# EAGLE design 1022main (EAGLE 6.0)
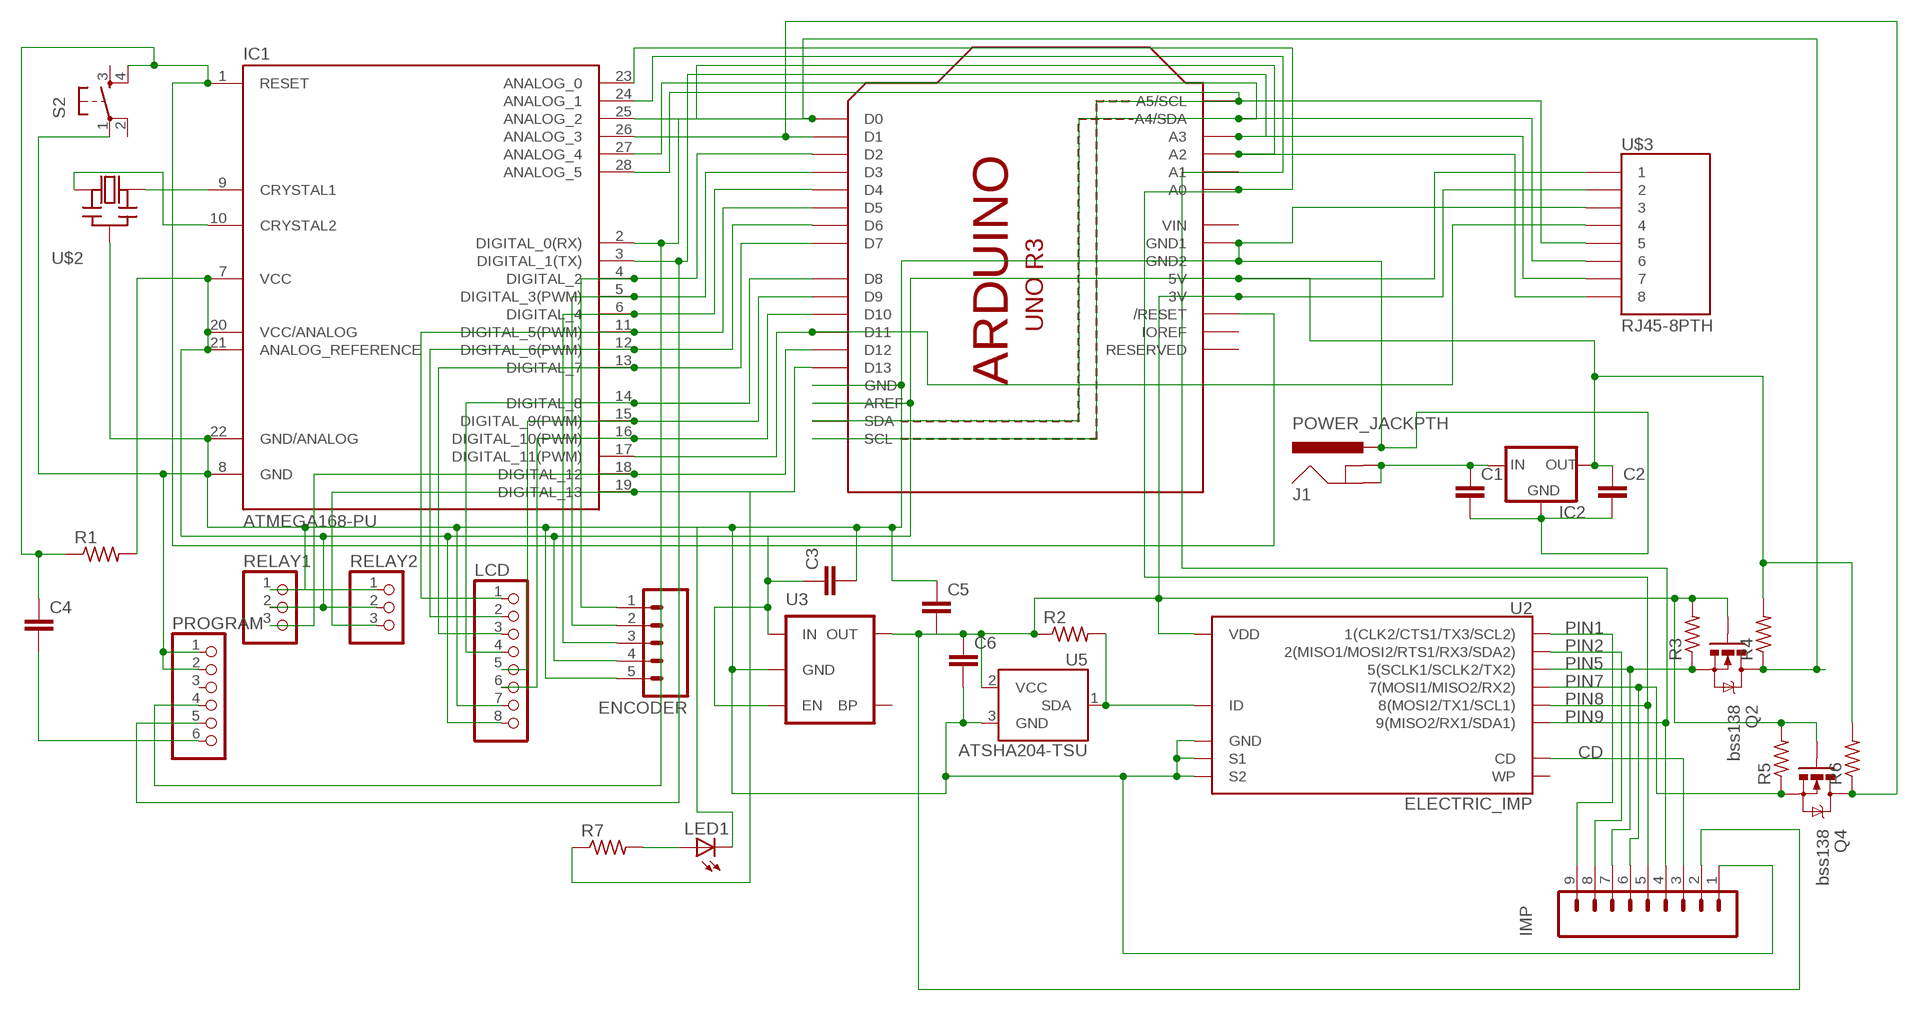
[diagram p0: schematic, sheet 1]

## Parts
C1  CAPPTH  [CAP-PTH-SMALL]
C2  CAPPTH  [CAP-PTH-SMALL]
C3  CAPPTH  [CAP-PTH-SMALL]
C4  CAPPTH  [CAP-PTH-SMALL]
C5  CAPPTH  [CAP-PTH-SMALL]
C6  CAPPTH  [CAP-PTH-SMALL]
ENCODER  M05PTH  [1X05]
IC1  ATMEGA168-PU  [DIL28-3]
IC2  V_REG_78XX-TO-220  [TO-220-ALT]
IMP  M09  [1X09]
J1  POWER_JACKPTH  [POWER_JACK_PTH]
LCD  PINHD-1X8CLEANBIG  [1X08-CLEANBIG]
LED1  LED3MM  [LED3MM]
PROGRAM  PINHD-1X6  [1X06]
Q2  bss138  MOSFET-NCHANNELSMD  [SOT23-3]
Q4  bss138  MOSFET-NCHANNELSMD  [SOT23-3]
R1  R-US_0204/7  [0204/7]
R2  R-US_0204/7  [0204/7]
R3  R-US_0204/7  [0204/7]
R4  R-US_0204/7  [0204/7]
R5  R-US_0204/7  [0204/7]
R6  R-US_0204/7  [0204/7]
R7  R-US_0204/7  [0204/7]
RELAY1  PINHD-1X3  [1X03]
RELAY2  PINHD-1X3  [1X03]
S2  TAC_SWITCHPTH  [TACTILE-PTH]
U1  ARDUINOR3-DIMENSION  [ARDUINOR3]
U2  ELECTRIC_IMP  [SD_MMC_SOCKET]
U3  V_REG_MIC52193.3V  [SOT23-5]
U5  ATSHA204-TSU  [SOT23-3]
U$2  CERMOSCILL-THM  [CERM_OSC]
U$3  RJ45-8PTH  [RJ45-8]

## Nets
3.3V: C5.2 C6.1 IMP.2 Q2.1(G) Q4.1(G) R2.1 R3.2 R5.2 U1.3V U2.4(VDD) U3.5(OUT) U5.2(VCC) U$3.2
CD: IMP.3 U2.CD
GND: C1.2 C2.2 C3.2 C5.1 C6.2 ENCODER.5 IC1.8(GND) IC1.22(GND/ANALOG) IC2.GND IMP.1 J1.PWR LCD.7 LED1.K(C) PROGRAM.1 PROGRAM.2 RELAY1.1 RELAY2.1 S2.1 U1.GND U1.GND1 U1.GND2 U2.3(GND) U2.S1 U2.S2 U3.2(GND) U5.3(GND) U$2.P$2(GND) U$3.3
N$1: IC1.19(DIGITAL_13) R7.1 RELAY2.3 U1.D13
N$2: IC1.18(DIGITAL_12) RELAY1.3 U1.D12
N$3: IC1.17(DIGITAL_11(PWM)) U1.D11 U$3.4
N$4: IC1.16(DIGITAL_10(PWM)) LCD.6 U1.D10
N$5: IC1.15(DIGITAL_9(PWM)) LCD.5 U1.D9
N$6: IC1.14(DIGITAL_8) LCD.4 U1.D8
N$7: IC1.13(DIGITAL_7) LCD.3 U1.D7
N$8: IC1.12(DIGITAL_6(PWM)) LCD.2 U1.D6
N$9: IC1.11(DIGITAL_5(PWM)) LCD.1 U1.D5
N$10: ENCODER.3 IC1.6(DIGITAL_4) U1.D4
N$11: ENCODER.2 IC1.5(DIGITAL_3(PWM)) U1.D3
N$12: ENCODER.1 IC1.4(DIGITAL_2) U1.D2
N$13: IC1.3(DIGITAL_1(TX)) PROGRAM.5 Q4.3(D) R6.1 U1.D1
N$14: IC1.2(DIGITAL_0(RX)) PROGRAM.4 Q2.3(D) R4.1 U1.D0
N$15: IC1.27(ANALOG_4) U1.A4(A4/SDA) U1.SDA U$3.6
N$16: IC1.28(ANALOG_5) U1.A5(A5/SCL) U1.SCL U$3.5
N$17: LED1.A R7.2
N$19: IC1.25(ANALOG_2) U1.A2 U$3.8
N$20: IC1.26(ANALOG_3) U1.A3 U$3.7
N$23: R2.2 U2.6(ID) U5.1(SDA)
N$24: C1.1 IC2.IN J1.GND J1.GNDBREAK
N$25: C4.2 PROGRAM.6
N$26: IC1.9(CRYSTAL1) U$2.P$3(OUT)
N$28: IC1.10(CRYSTAL2) U$2.P$1(IN)
N$35: C2.1 C3.1 ENCODER.4 IC1.7(VCC) IC1.20(VCC/ANALOG) IC1.21(ANALOG_REFERENCE) IC2.OUT LCD.8 R1.2 R4.2 R6.2 RELAY1.2 RELAY2.2 U1.5V U1.AREF U3.1(IN) U3.3(EN) U$3.1
PIN1: IMP.9 U2.1(1(CLK2/CTS1/TX3/SCL2))
PIN2: IMP.8 U2.2(2(MISO1/MOSI2/RTS1/RX3/SDA2))
PIN5: IMP.7 Q2.2(S) R3.1 U2.5(5(SCLK1/SCLK2/TX2))
PIN7: IMP.6 Q4.2(S) R5.1 U2.7(7(MOSI1/MISO2/RX2))
PIN8: IC1.23(ANALOG_0) IMP.5 U1.A0 U2.8(8(MOSI2/TX1/SCL1))
PIN9: IC1.24(ANALOG_1) IMP.4 U1.A1 U2.9(9(MISO2/RX1/SDA1))
RELAY1: C4.1 IC1.1(RESET) R1.1 S2.4 U1.RESET(/RESET)
Unconnected: PROGRAM.3 S2.2 S2.3 U1.IOREF U1.RESERVED U2.WP U3.4(BP)

## Power pins joined to a net without a drawn wire
VIN: U1.VIN

## Library data of the parts
C1-C6 = SparkFun:CAP: Capacitor Standard 0603 ceramic capacitor, and 0.1" leaded capacitor.
ENCODER = SparkFun-Connectors:M05: Header 5 Standard 5-pin 0.1" header. Use with straight break away headers (SKU : PRT-00116), right angle break away headers (PRT-00553), swiss pins (PRT-00743), machine pins (PRT-00117), and female headers (PRT-00115). Molex polarized connector foot print use with SKU : PRT-08230 with associated crimp pins and housings.
IC1 = Arduino-AVR:ATMEGA168-PU
IC2 = SparkFun:V_REG_78XX: Voltage Regulator Standard 7805 5V regulator. IGO (Input Ground Output). Spark Fun Electronics SKU : COM-00107
IMP = SparkFun:M09: Header 9 Standard 9-pin 0.1" header. Use with straight break away headers (SKU : PRT-00116), right angle break away headers (PRT-00553), swiss pins (PRT-00743), machine pins (PRT-00117), and female headers (PRT-00115).
J1 = SparkFun:POWER_JACK: Power Jack This is the standard 5.5mm barrel jack for power. The PTH is the most common, proven, reliable, footprint. All others are experimental. The Slot footprint only works if the mill layer is transmitted to the PCB fab house so be warned. Spark Fun Electronics SKU : PRT-00119. Mating wall wart : TOL-00298 (and others)
LCD = adafruit:PINHD-1X8: PIN HEADER
LED1 = adafruit:LED: LED OSRAM: - CHIPLED LG R971, LG N971, LY N971, LG Q971, LY Q971, LO R971, LY R971 LH N974, LH R974 LS Q976, LO Q976, LY Q976 LO Q996 - Hyper CHIPLED LW Q18S LB Q993, LB Q99A, LB R99A - SideLED LS A670, LO A670, LY A670, LG A670, LP A670 LB A673, LV A673, LT A673, LW A673 LH A674 LY A675 LS A676, LA A676, LO A676, LY A676, LW A676 LS A679, LY A679, LG A679 - Hyper Micro SIDELED® LS Y876, LA Y876, LO Y876, LY Y876 LT Y87S - SmartLED LW L88C, LW L88S LB L89C, LB L89S, LG L890 LS L89K, LO L89K, LY L89K LS L896, LA L896, LO L896, LY L896 - TOPLED LS T670, LO T670, LY T670, LG T670, LP T670 LSG T670, LSP T670, LSY T670, LOP T670, LYG T670 LG T671, LOG T671, LSG T671 LB T673, LV T673, LT T673, LW T673 LH T674 LS T676, LA T676, LO T676, LY T676, LB T676, LH T676, LSB T676, LW T676 LB T67C, LV T67C, LT T67C, LS T67K, LO T67K, LY T67K, LW E67C LS E67B, LA E67B, LO E67B, LY E67B, LB E67C, LV E67C, LT E67C LW T67C LS T679, LY T679, LG T679 LS T770, LO T770, LY T770, LG T770, LP T770 LB T773, LV T773, LT T773, LW T773 LH T774 LS E675, LA E675, LY E675, LS T675 LS T776, LA T776, LO T776, LY T776, LB T776 LHGB T686 LT T68C, LB T68C - Hyper Mini TOPLED® LB M676 - Mini TOPLED Santana® LG M470 LS M47K, LO M47K, LY M47K Source: http://www.osram.convergy.de/
PROGRAM = adafruit:PINHD-1X6: PIN HEADER
Q2 Q4 = SparkFun-DiscreteSemi:MOSFET-NCHANNEL: Generic NMOS footprint
R1-R7 = adafruit:R-US_: RESISTOR, American symbol
RELAY1 RELAY2 = adafruit:PINHD-1X3: PIN HEADER
S2 = nouveau:TAC_SWITCH: Momentary Switch Button commonly used for reset or general input. Spark Fun Electronics SKU : COM-00097
U1 = adafruit:ARDUINOR3: This is a new object for the new Arduino R3 - with extra pins that you may want to use (such as IOref, and duplicated A4/A5
U2 = SparkFun-RF:ELECTRIC_IMP
U3 = SparkFun-PowerIC:V_REG_MIC5219: V_REG MIC5219 Standard 500mA LDO voltage regulator in SOT-23 layout. Micrel part MIC5219. BP (by-pass) pin is used to lower output noise with 470pF cap, may be left open.; PROD_ID: VREG-09872; VALUE: MIC5219 3.3V
U5 = SparkFun-DigitalIC:ATSHA204
U$2 = adafruit:CERMOSCILL: Ceramic oscillator with built in capacitors such as ZTT-12MHz http://www.ladyada.net/library/eagle
U$3 = SparkFun:RJ45-8: RJ45 Jack Simple RJ45, 8-pin connection - connector for common Cat5, Cat5e, and Cat6 Ethernet cables. Footprint not yet proven in production. Connector sku is PRT-00643; Breakout PCB sku is BOB-00716.

## Board
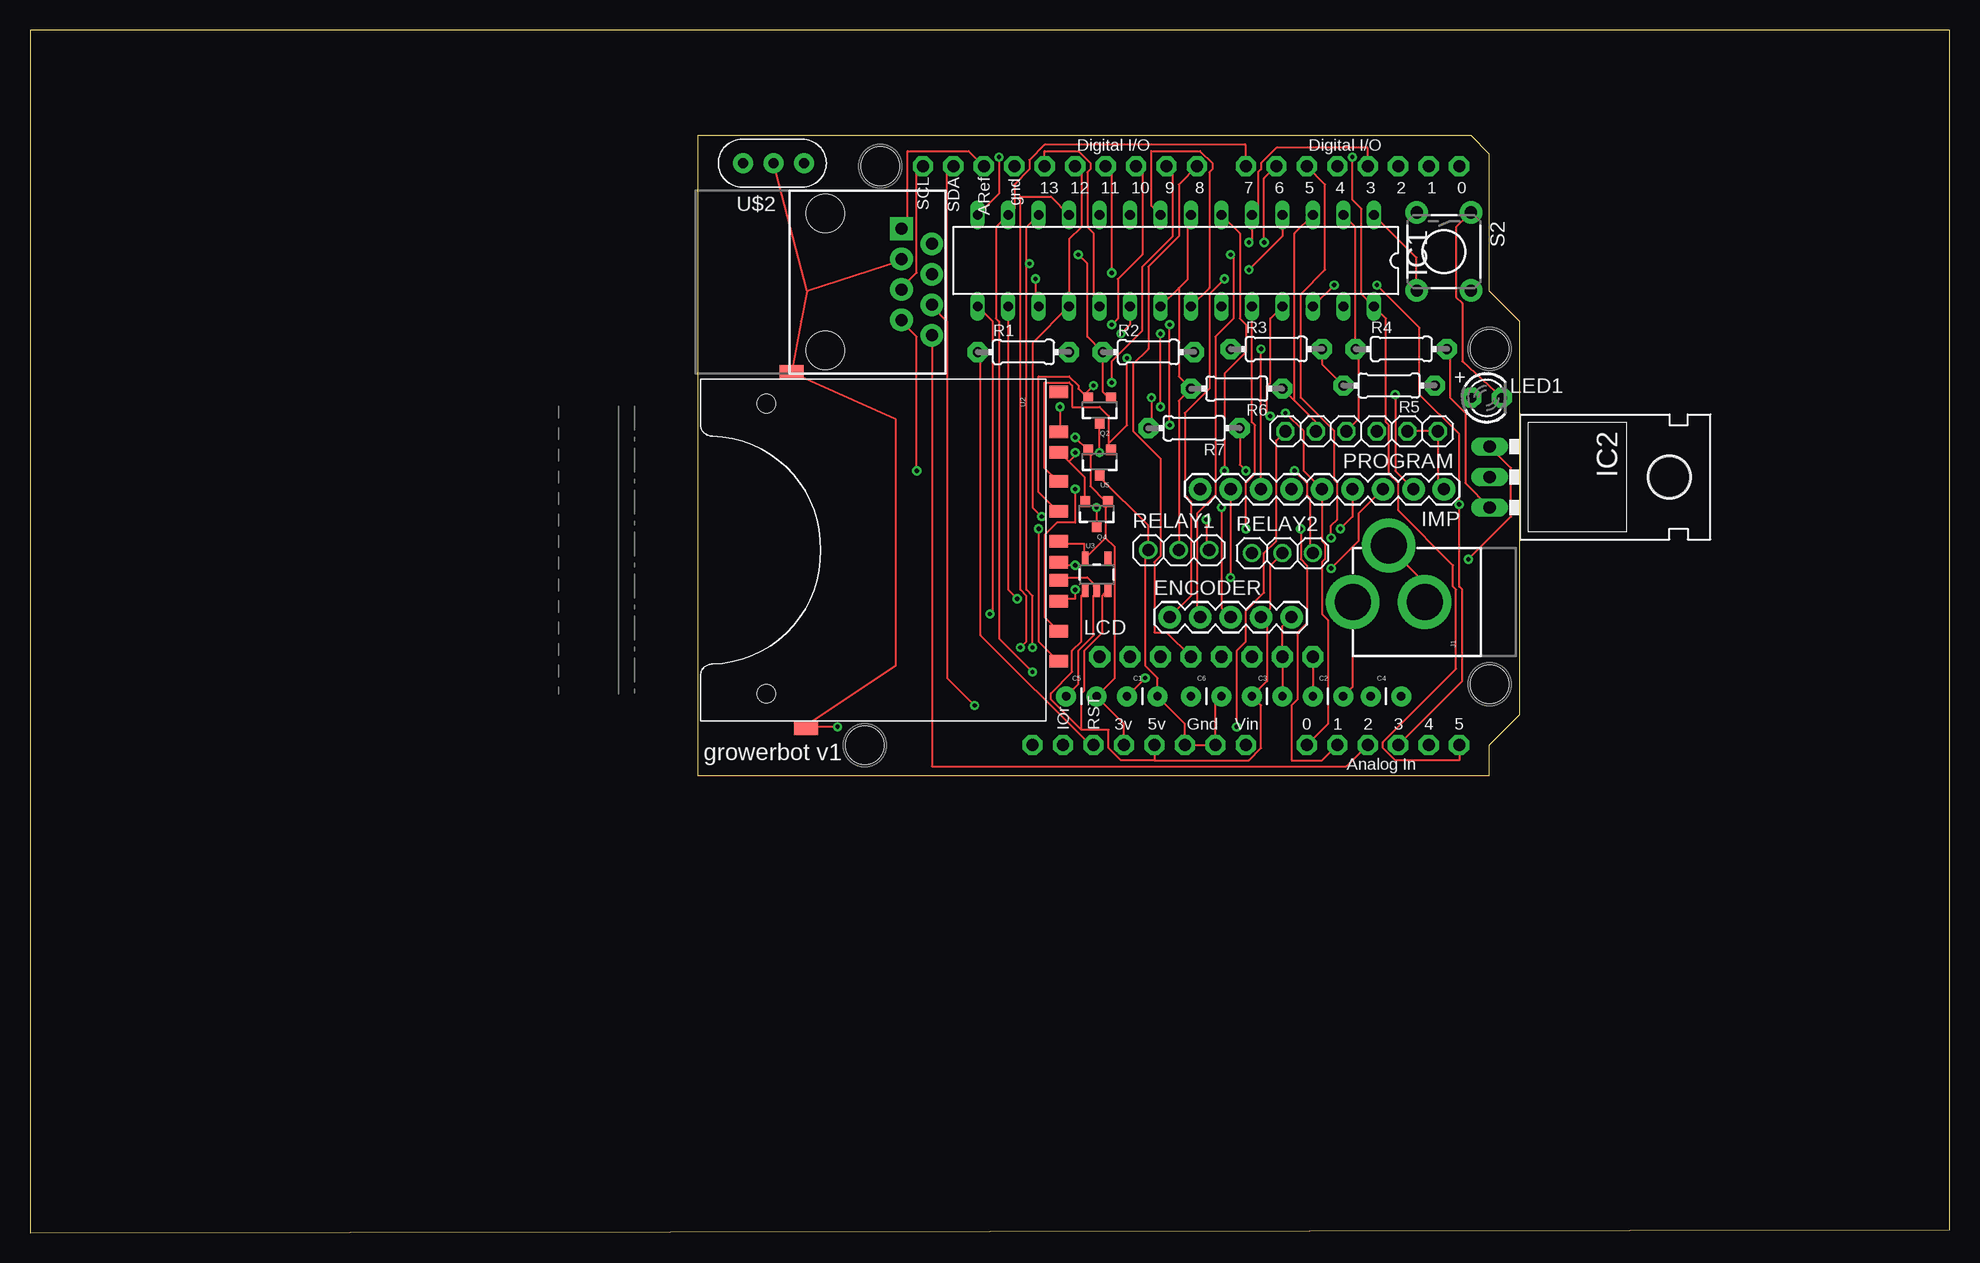
[diagram p1: board, top side]
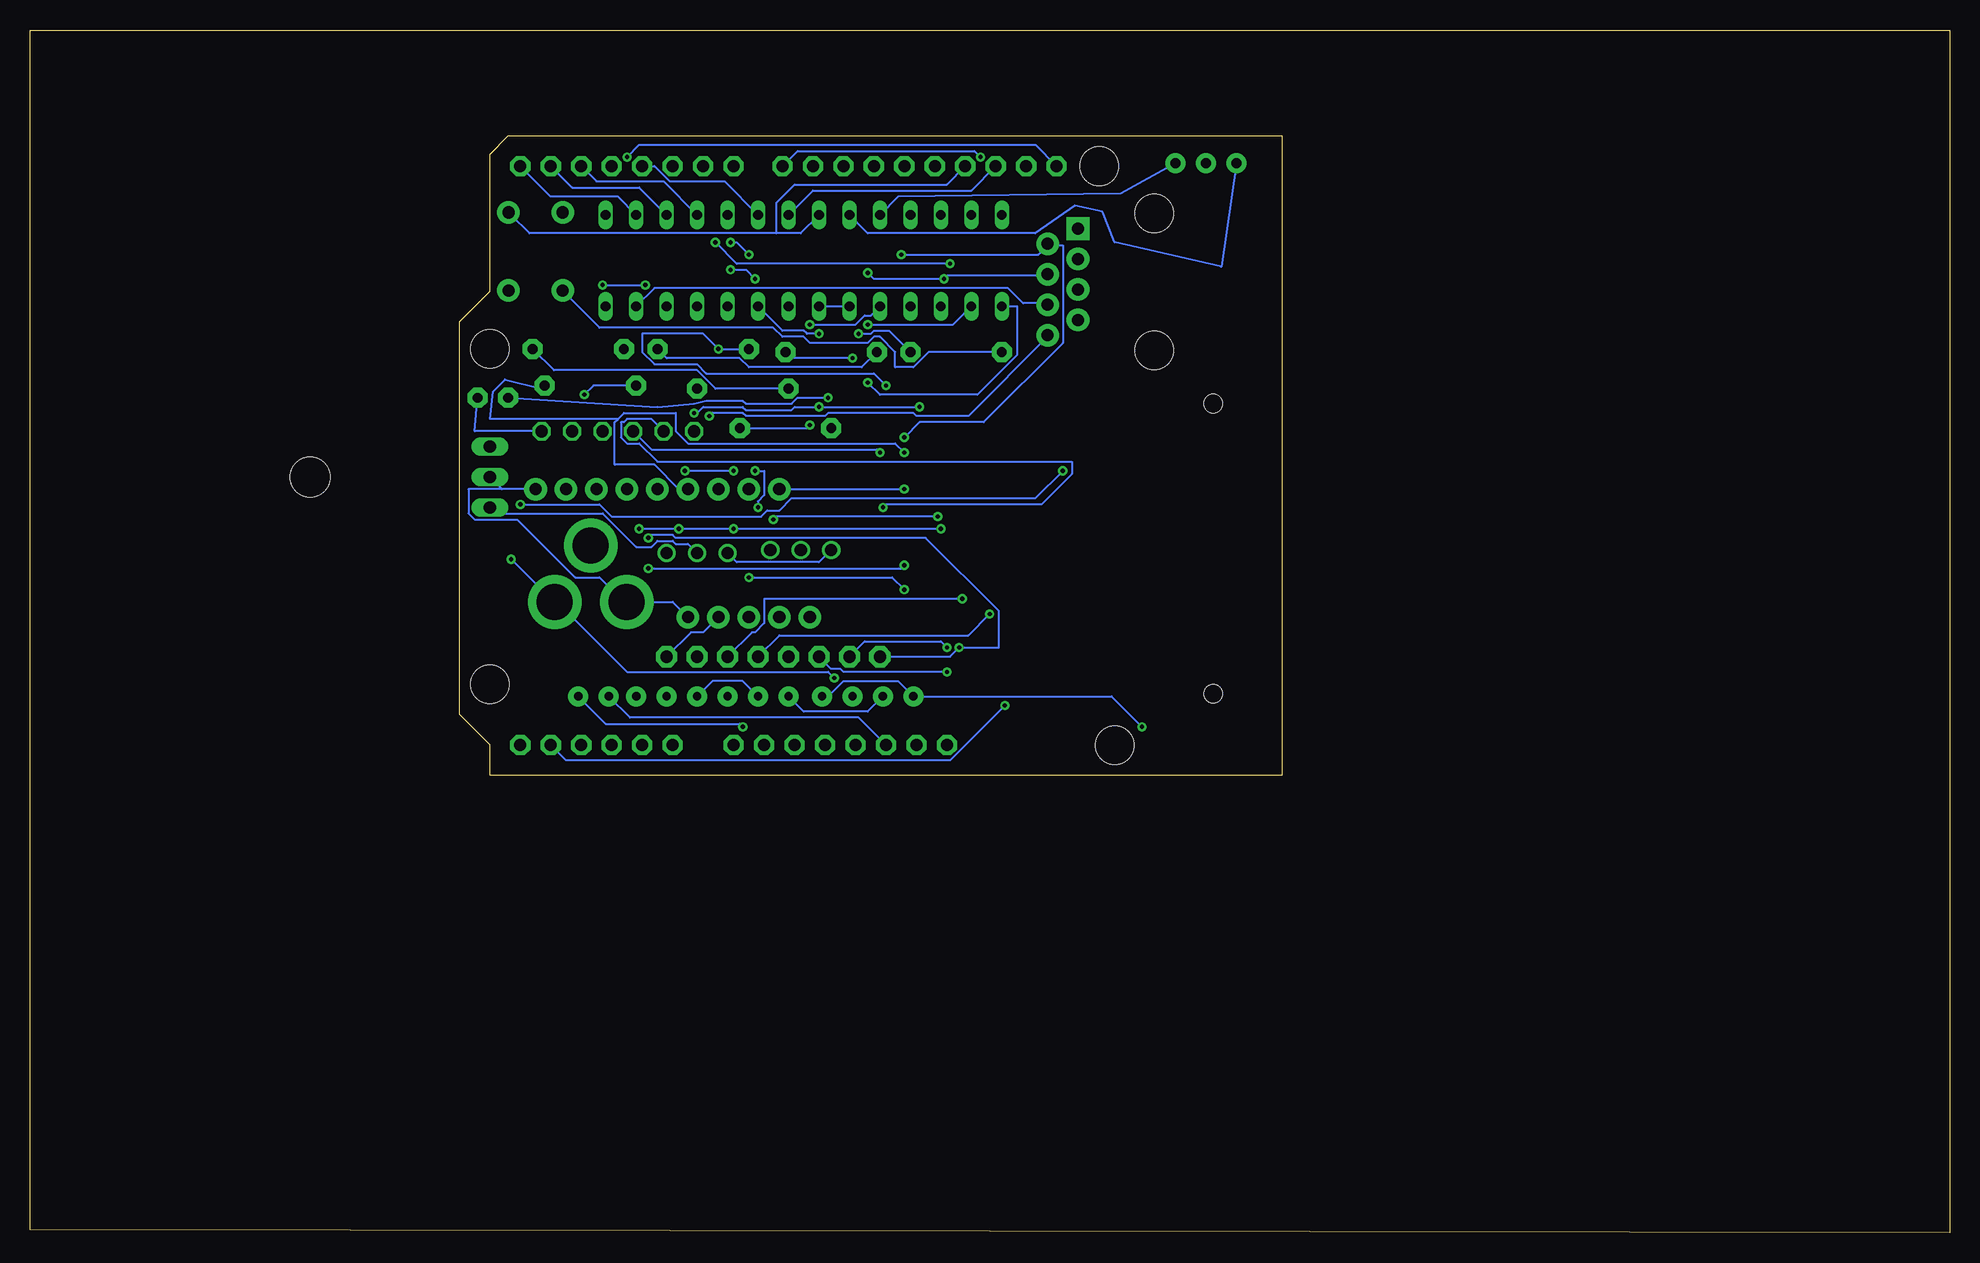
[diagram p2: board, bottom side, seen from below]

Size 160 x 100.25 mm. Coordinates in mm from the lower left corner, seen from the top.
Outline: 0,0 160,0.25 160,100.25 0,100.25 0,0
Copper layers (1*16): Top 0.0178mm / dielectric 59mil / Bottom 0.0178mm
Design rules: minimum track width 6mil, minimum drill 14mil, track to track 6mil, track to pad 6mil, pad to pad 6mil, via to via 6mil, smd to smd 6mil, copper to edge 20mil, drill to drill 16mil, minimum pad ring 8mil, minimum via ring 8mil, stop-mask expansion 3mil, vias tented up to drill 0mil, thermal gap 10mil
Holes 3.2 mm at 69.6,40.64 121.67,45.72 70.87,88.9 121.67,73.66

### Footprints (pad centres in the part's own frame; a part is rotated, then mirrored left to right if it is on the bottom)
CAP-PTH-SMALL = drill 0.7 pad 1.651: 1 0,0; 2 2.54,0
1X05 = drill 1.016 pad 1.88: 1 0,0; 2 2.54,0; 3 5.08,0; 4 7.62,0; 5 10.16,0
DIL28-3 = drill 0.813 long: 1 -16.51,-3.81; 2 -13.97,-3.81; 3 -11.43,-3.81; 4 -8.89,-3.81; 5 -6.35,-3.81; 6 -3.81,-3.81; 7 -1.27,-3.81; 8 1.27,-3.81; 9 3.81,-3.81; 10 6.35,-3.81; 11 8.89,-3.81; 12 11.43,-3.81; 13 13.97,-3.81; 14 16.51,-3.81; 15 16.51,3.81; 16 13.97,3.81; 17 11.43,3.81; 18 8.89,3.81; 19 6.35,3.81; 20 3.81,3.81; 21 1.27,3.81; 22 -1.27,3.81; 23 -3.81,3.81; 24 -6.35,3.81; 25 -8.89,3.81; 26 -11.43,3.81; 27 -13.97,3.81; 28 -16.51,3.81
TO-220-ALT = drill 1.016 long: GND 0,-3.81; IN -2.54,-3.81; OUT 2.54,-3.81 | hole 3.302: 0,11.176
1X09 = drill 1.016 pad 1.88: 1 0,0; 2 2.54,0; 3 5.08,0; 4 7.62,0; 5 10.16,0; 6 12.7,0; 7 15.24,0; 8 17.78,0; 9 20.32,0
POWER_JACK_PTH = drill 2.997 pad 4.318: GND 0,7.7; GNDBREAK 4.7,10.7; PWR 0,13.7
1X08-CLEANBIG = drill 1.016 pad 1.778 octagon: 1 -8.89,0; 2 -6.35,0; 3 -3.81,0; 4 -1.27,0; 5 1.27,0; 6 3.81,0; 7 6.35,0; 8 8.89,0
LED3MM = drill 0.813 pad 1.676 octagon: A -1.27,0; K 1.27,0
1X06 = drill 1.016 octagon: 1 -6.35,0; 2 -3.81,0; 3 -1.27,0; 4 1.27,0; 5 3.81,0; 6 6.35,0
SOT23-3 = smd 0.8 x 0.9: 1 -0.95,-1; 2 0.95,-1; 3 0,1.1
0204/7 = drill 0.813 pad 1.676 octagon: 1 -3.81,0; 2 3.81,0
1X03 = drill 1.016: 1 -2.54,0; 2 0,0; 3 2.54,0
TACTILE-PTH = drill 1.016 pad 1.88: 1 -3.251,2.261; 2 3.251,2.261; 3 -3.251,-2.261; 4 3.251,-2.261
ARDUINOR3 = drill 1 pad 1.676 octagon: 3V 35.56,2.54; 5V 38.1,2.54; A0 50.8,2.54; A1 53.34,2.54; A2 55.88,2.54; A3 58.42,2.54; A4 60.96,2.54; A5 63.5,2.54; AREF 23.876,50.8; D0 63.5,50.8; D1 60.96,50.8; D2 58.42,50.8; D3 55.88,50.8; D4 53.34,50.8; D5 50.8,50.8; D6 48.26,50.8; D7 45.72,50.8; D8 41.656,50.8; D9 39.116,50.8; D10 36.576,50.8; D11 34.036,50.8; D12 31.496,50.8; D13 28.956,50.8; GND 26.416,50.8; GND1 43.18,2.54; GND2 40.64,2.54; IOREF 30.48,2.54; RESERVED 27.94,2.54; RESET 33.02,2.54; SCL 18.796,50.8; SDA 21.336,50.8; VIN 45.72,2.54
SD_MMC_SOCKET = smd 1.05 x 1.56: 1 6.77,29.87; 2 4.27,29.87; 3 2.52,29.87; 4 -0.73,29.87; 5 -3.23,29.87; 6 -5.73,29.87; 7 -8.15,29.87; 8 -9.85,29.87; 9 9.27,29.87; CD 1.02,29.87; WP -13.2,29.87 | smd 1.2 x 2: S1 -14.8,7.6; S2 14.8,8.8 | hole 1.55: 11.98,5.5; -12.22,5.5
SOT23-5 = smd 0.55 x 1.2: 1 -0.95,-1.3; 2 0,-1.3; 3 0.95,-1.3; 4 0.95,1.3; 5 -0.95,1.3
CERM_OSC = drill 0.813 pad 1.676: P$1 -2.54,0; P$2 0,0; P$3 2.54,0
RJ45-8 = drill 1 pad 1.88 square: 1 -4.445,6.35 | drill 1 pad 1.88: 2 -3.175,8.89; 3 -1.905,6.35; 4 -0.635,8.89; 5 0.635,6.35; 6 1.905,8.89; 7 3.175,6.35; 8 4.445,8.89 | hole 3.2: -5.715,0; 5.715,0

### Placement (x,y rotation side)
C1  91.44,44.7 0 top
C2  106.93,44.7 0 top
C3  101.85,44.7 0 top
C4  111.76,44.7 0 top
C5  86.36,44.7 0 top
C6  96.77,44.7 0 top
ENCODER  95,51.31 0 top
IC1  95.5,81.03 180 top
IC2  125.48,62.99 270 top
IMP  117.86,61.98 180 top
J1  123.95,52.58 90 top
LCD  98.04,48.01 0 top
LED1  121.41,69.6 0 top
PROGRAM  111,66.8 180 top
Q2  89.15,68.58 180 top
Q4  88.9,59.94 180 top
R1  82.8,73.41 0 top
R2  93.22,73.41 0 top
R3  103.89,73.66 0 top
R4  114.3,73.66 0 top
R5  113.28,70.61 180 top
R6  100.58,70.36 180 top
R7  97.03,67.06 180 top
RELAY1  95.76,56.9 0 top
RELAY2  104.39,56.64 0 top
S2  117.86,81.79 270 top
U1  55.63,38.1 0 top
U2  55.88,56.9 270 top
U3  88.9,54.86 0 top
U5  89.15,64.26 180 top
U$2  61.98,89.15 180 top
U$3  66.29,79.25 270 top

### Tracks (layer width: path | path; a pad name or v marks a point on that pad's centre or on a via)
3.3V  (via drill 0.36)
  Top 0.152: 89.66,57.91 88.14,56.39 U3.5 87.88,56.39 87.88,57.4 85.85,57.4 U2.4 | 89.66,57.91 89.66,60.71 Q4.1 89.66,60.96 88.39,62.23 88.39,65.02 U5.2 88.14,65.28 v87.12,66.29 | U1.3V 91.19,42.42 C5.2 90.42,46.23 90.42,57.15 89.66,57.91 | R5.2 107.7,72.39 R3.2 | IMP.2 113.79,63.5 v113.79,69.85 | Q2.1 89.92,69.6 89.41,70.1 R2.1 88.14,74.68 88.14,80.77 v87.38,81.53
  Bottom 0.152: C6.1 95.5,43.43 90.17,43.43 C5.2 | v113.79,69.85 113.03,70.61 R5.2 | 75.18,82.3 75.95,81.53 v87.38,81.53 | R3.2 106.93,72.9 100.84,72.9 100.08,72.14 90.68,72.14 R2.1 | v87.12,66.29 85.85,67.56 80.52,67.56 73.91,74.17 73.91,82.3 75.18,82.3 | 75.18,82.3 U$3.2
CD  (via drill 0.36)
  Top 0.152: v87.12,55.63 85.85,55.63 U2.CD | v108.46,55.37 110.74,57.66 110.74,59.94 IMP.3
  Bottom 0.152: v87.12,55.63 87.38,55.37 v108.46,55.37
GND  (via drill 0.36)
  Top 0.152: 64.77,78.49 72.64,81.03 U$3.3 | 64.77,78.49 64.26,75.95 U2.S1 72.14,67.82 72.14,47.24 64.52,42.16 U2.S2 64.77,42.16 v67.31,42.16 | 64.77,78.49 U$2.P$2 | C3.2 LCD.7 104.39,50.55 ENCODER.5 | C2.2 110.24,45.47 110.24,52.58 J1.PWR | U5.3 89.15,62.99 93.22,58.93 RELAY1.1 92.96,56.64 92.96,47.24 93.98,46.23 C1.2 96.27,42.42 U1.GND2 U1.GND1 98.81,44.2 C6.2 | U2.3 85.85,54.61 88.14,54.61 88.65,54.1 88.65,53.85 88.9,53.59 U3.2 88.9,53.34 88.65,53.09 88.65,49.78 87.38,48.51 87.38,45.72 C5.1 | PROGRAM.2 PROGRAM.1 117.35,62.48 IMP.1 | IC1.22 98.3,78.74 98.3,88.39 98.55,88.65 98.55,89.15 97.54,90.17 93.47,90.17 93.47,85.6 IC1.8 | LED1.K 119.38,72.64 119.38,77.47 118.87,77.98 118.87,83.82 119.89,84.84 S2.1
  Bottom 0.152: ENCODER.5 106.43,52.58 J1.PWR 110.49,52.58 112.52,54.61 114.55,54.61 119.38,59.44 122.94,59.44 123.44,59.94 123.44,61.98 120.65,61.98 | RELAY2.1 101.09,55.88 94.23,55.88 RELAY1.1 | C1.2 93.47,44.7 92.2,45.97 87.63,45.97 C5.1 69.85,44.7 v67.31,42.16 | C3.2 103.12,45.97 100.58,45.97 C6.2 | 120.65,61.98 IC2.GND | IMP.1 120.65,61.98 | LED1.K 122.94,66.8 PROGRAM.1 | U1.GND 83.57,87.38 96.27,87.38 97.79,85.85 97.79,83.31 | 97.79,83.31 95.76,83.31 IC1.8 | 97.79,83.31 118.36,83.31 119.89,84.84 S2.1
N$1  (via drill 0.36)
  Top 0.152: IC1.19 88.65,77.72 88.65,83.31 88.14,83.82 88.14,88.39 88.39,88.65 88.39,89.15 87.38,90.17 84.58,90.17 U1.D13 | RELAY2.3 106.68,56.9 106.68,61.21 106.43,61.47 106.43,62.48 v105.41,63.5 | v101.35,63.5 100.84,64.01 R7.1 | v95,67.31 v95,75.69
  Bottom 0.152: v101.35,63.5 v105.41,63.5 | IC1.19 89.92,76.45 90.42,76.45 91.19,75.69 v95,75.69 | v95,67.31 95.25,67.06 R7.1
N$2  (via drill 0.36)
  Top 0.152: U1.D12 87.63,88.39 87.63,83.82 86.61,82.8 IC1.18 83.57,74.17 83.57,60.45 v84.33,59.69 | RELAY1.3 98.04,57.15 v98.04,59.44
  Bottom 0.152: v98.04,59.44 97.79,59.69 v84.33,59.69
N$3  (via drill 0.36)
  Top 0.152: IC1.17 83.82,77.47 v83.82,79.5 | U1.D11 90.17,88.39 v90.17,80.01
  Bottom 0.152: U$3.4 75.18,79.76 83.57,79.76 v83.82,79.5 89.66,79.5 v90.17,80.01
N$4  (via drill 0.36)
  Top 0.152: v90.17,75.69 90.68,76.2 90.68,79.5 92.71,81.53 92.71,88.39 U1.D10 | v82.3,52.83 81.53,53.59 IC1.16
  Bottom 0.152: IC1.16 83.06,75.69 v90.17,75.69 | LCD.6 99.82,50.04 99.57,50.04 98.81,50.8 98.81,52.83 v82.3,52.83
N$5  (via drill 0.36)
  Top 0.152: IC1.15 80.26,75.95 80.26,51.82 v80.01,51.56 | U1.D9 95.25,88.39 95.25,83.06 92.71,80.52 92.71,75.18 90.17,72.64 v90.17,70.87
  Bottom 0.152: v80.01,51.56 81.79,49.78 97.54,49.78 LCD.5 | v90.17,70.87 89.15,69.85 81.03,69.85 77.72,73.15 77.72,77.22 IC1.15
N$6  (via drill 0.36)
  Top 0.152: IC1.14 80.77,86.61 v80.77,89.66 | LCD.4 94.74,50.04 93.73,50.04 93.73,55.88 94.23,56.39 94.23,64.52 91.95,66.8 91.95,72.39 93.22,73.66 93.22,80.52 95.76,83.06 95.76,87.38 U1.D8
  Bottom 0.152: v80.77,89.66 81.28,90.17 96.01,90.17 U1.D8
N$7  (via drill 0.36)
  Top 0.152: U1.D7 101.35,90.68 84.58,90.68 83.31,89.41 83.31,88.65 82.04,87.38 82.04,85.34 IC1.13 80.52,83.82 80.52,76.2 80.77,75.95 80.77,49.53 v83.57,46.74
  Bottom 0.152: LCD.3 93.22,46.99 92.46,46.99 92.2,46.74 v83.57,46.74
N$8  (via drill 0.36)
  Top 0.152: IC1.12 83.06,83.82 83.06,80.77 | 83.06,80.77 83.06,53.59 83.57,53.09 v83.57,48.77 | U1.D6 102.87,87.88 v102.87,82.55 | 83.06,80.77 v83.31,80.77
  Bottom 0.152: v83.57,48.77 84.07,49.28 90.42,49.28 LCD.2 | v102.87,82.55 101.09,80.77 v83.31,80.77
N$9  (via drill 0.36)
  Top 0.152: IC1.11 85.09,86.36 82.55,86.36 82.55,53.59 83.06,53.09 83.06,49.28 v82.55,48.77 | U1.D5 107.95,87.38 107.95,80.26 105.92,78.23 105.92,69.6 108.71,66.8 108.71,62.74 108.97,62.48 108.97,59.44 108.46,58.93 v108.46,57.91
  Bottom 0.152: LCD.1 83.31,48.01 v82.55,48.77 79.25,48.77 79.25,51.82 85.34,57.91 106.17,57.91 106.43,58.17 108.2,58.17 v108.46,57.91
N$10  (via drill 0.36)
  Top 0.152: ENCODER.3 99.31,52.07 v99.31,60.45 | v99.57,63.5 99.57,71.63 101.35,73.41 101.35,75.69 100.84,76.2 100.84,83.31 IC1.6
  Bottom 0.152: IC1.6 102.11,87.63 106.68,87.63 107.95,88.9 U1.D4 | v99.31,60.45 99.31,60.96 98.81,61.47 98.81,63.5 v99.57,63.5
N$11  (via drill 0.36)
  Top 0.152: U1.D3 111.51,90.42 103.89,90.42 102.62,89.15 102.62,88.65 102.36,88.39 102.36,85.34 IC1.5 101.85,82.8 v101.6,82.55 | ENCODER.2 97.28,51.56 97.28,59.94 98.81,61.47 98.81,74.68 100.33,76.2 100.33,81.28 v100.08,81.53
  Bottom 0.152: v100.08,81.53 101.09,82.55 v101.6,82.55
N$12  (via drill 0.36)
  Top 0.152: ENCODER.1 96.77,53.09 96.77,60.96 96.27,61.47 96.27,68.33 98.3,70.36 98.3,78.23 v99.57,79.5 | v101.6,80.26 104.39,83.06 IC1.4
  Bottom 0.152: IC1.4 107.19,87.63 112.78,87.63 U1.D2 | v99.57,79.5 100.33,80.26 v101.6,80.26
N$13  (via drill 0.36)
  Top 0.152: v88.9,60.45 Q4.3 | 105.41,69.34 107.19,67.56 PROGRAM.5 | 105.41,69.34 R6.1 | IC1.3 105.41,83.31 105.41,69.34
  Bottom 0.152: IC1.3 109.22,87.12 114.81,87.12 U1.D1 | v88.9,60.45 88.65,60.71 75.69,60.71 73.15,63.25 73.15,64.26 107.7,64.26 109.22,65.79 110.24,65.79 110.74,66.29 110.74,67.56 110.49,67.56 110.24,67.82 108.2,67.82 PROGRAM.5
N$14  (via drill 0.36)
  Top 0.152: v89.15,65.02 Q2.3 | IC1.2 110.49,83.82 R4.1 110.74,73.41 110.74,67.82 PROGRAM.4
  Bottom 0.152: v89.15,65.02 89.41,65.28 108.2,65.28 PROGRAM.4 | U1.D0 116.59,86.36 111,86.36 IC1.2
N$15  (via drill 0.36)
  Top 0.152: v78.74,43.94 76.45,46.23 76.45,75.95 | 76.45,75.95 75.18,77.22 U$3.6 | U1.SDA 76.45,88.39 76.45,75.95
  Bottom 0.152: IC1.27 107.95,78.74 78.49,78.74 77.22,77.47 75.18,77.47 U$3.6 | U1.A4 115.32,39.37 83.31,39.37 v78.74,43.94
N$16  (via drill 0.36)
  Top 0.152: U1.SCL 73.91,88.39 73.91,80.01 72.64,78.74 U$3.5 | U1.A5 119.13,39.37 113.79,39.37 112.78,40.39 112.78,40.89 118.87,46.99 118.87,53.59 118.62,53.85 118.62,55.63 114.05,60.2 114.05,62.48 113.28,63.25 113.28,67.31 113.03,67.56 113.03,76.2 IC1.28 111,78.23 111,85.34 110.24,86.11 v110.24,89.66
  Bottom 0.152: U1.SCL 76.2,90.68 109.22,90.68 v110.24,89.66
N$17  (via drill 0.36)
  Top 0.152: R7.2 93.47,67.31 v93.47,69.6
  Bottom 0.152: v93.47,69.6 96.01,69.6 96.52,69.09 100.33,69.09 100.58,69.34 103.63,69.34 104.65,69.09 107.7,68.83 LED1.A
N$19  (via drill 0.36)
  Top 0.152: IC1.25 103.38,76.2 103.38,70.87 103.12,70.61 103.12,68.33 v103.38,68.07 | U1.A2 109.73,38.86 75.18,38.86 U$3.8
  Bottom 0.152: v103.38,68.07 103.12,68.33 100.58,68.33 100.33,68.07 93.73,68.07 93.47,68.33 86.36,68.33 86.11,68.07 81.79,68.07 75.18,74.68 U$3.8
N$20  (via drill 0.36)
  Top 0.152: v108.71,78.99 IC1.26 | v112.27,78.99 115.82,75.44 115.82,69.85 119.13,66.55 v119.13,60.71 119.13,53.85 119.38,53.59 119.38,45.97 U1.A3 | v73.91,63.5 73.91,74.68 72.64,75.95 U$3.7
  Bottom 0.152: v112.27,78.99 v108.71,78.99 | v73.91,63.5 76.2,61.21 96.52,61.21 97.54,60.2 98.55,60.2 99.06,59.69 111.51,59.69 112.52,60.71 v119.13,60.71
N$23  (via drill 0.36)
  Top 0.152: 89.92,65.79 89.92,68.07 89.15,68.83 86.87,68.83 86.87,70.61 86.61,70.87 84.58,70.87 84.58,63.75 85.6,62.74 U2.6 | 89.92,65.79 89.92,65.28 U5.1 | v91.44,72.9 91.44,67.31 89.92,65.79
  Bottom 0.152: R2.2 96.52,72.9 v91.44,72.9
N$24  (via drill 0.36)
  Top 0.152: IC2.IN 123.44,63.75 123.44,59.69 v119.89,56.13 | v92.96,46.23 C1.1 | J1.GNDBREAK 113.28,57.15 116.08,54.36 116.08,52.58 J1.GND
  Bottom 0.152: v119.89,56.13 116.33,52.58 J1.GND 116.08,52.58 110.24,46.74 93.47,46.74 v92.96,46.23
N$25  (via drill 0.36)
  Top 0.152: PROGRAM.6 103.89,66.04 103.89,57.66 102.87,56.64 102.87,53.34 101.35,51.82 101.35,49.28 100.58,48.51 v100.58,42.16
  Bottom 0.152: v100.58,42.16 100.84,42.42 112.01,42.42 C4.2
N$26
  Bottom 0.152: IC1.9 90.17,83.31 76.2,83.31 72.9,85.6 70.61,85.09 69.6,82.55 60.71,80.52 U$2.P$3
N$28
  Bottom 0.152: IC1.10 87.63,86.36 69.09,86.61 U$2.P$1
N$35  (via drill 0.36)
  Top 0.152: LCD.8 C2.1 | RELAY2.2 103.38,55.63 103.38,52.07 103.12,51.82 | 103.12,51.82 103.12,45.97 C3.1 102.62,43.94 102.62,40.39 101.6,39.37 93.73,39.37 | 103.12,51.82 ENCODER.4 | 87.63,41.91 85.09,44.45 85.09,44.96 86.87,46.74 86.87,48.51 87.63,49.28 87.63,53.09 87.88,53.34 U3.1 | 87.63,41.91 89.92,41.91 89.92,40.39 90.93,39.37 93.73,39.37 | U1.5V 93.73,39.37 | 87.63,41.91 87.63,44.96 87.88,45.21 87.88,48.51 89.41,50.04 89.41,53.09 89.66,53.34 U3.3 | IC2.OUT 119.63,62.48 119.63,68.33 118.36,69.6 118.36,73.41 R4.2 | RELAY1.2 95.76,69.34 R6.2 95.76,71.37 95.76,78.74 | U1.AREF 78.23,90.17 73.15,90.17 73.15,84.33 72.64,83.82 U$3.1 | IC1.7 96.52,84.58 96.52,79.5 95.76,78.74 | IC1.21 95.76,78.74 | v90.93,74.93 91.69,75.69 IC1.20
  Bottom 0.152: LCD.8 104.9,50.04 103.89,50.04 ENCODER.4 | IC1.21 IC1.20 | R1.2 88.39,75.18 89.66,75.18 89.92,74.93 v90.93,74.93 | U1.AREF 81.53,86.87 94.74,86.87 IC1.7 | R4.2 116.33,71.88 104.39,71.88 102.87,70.36 R6.2 | RELAY2.2 105.16,57.4 106.17,57.4 106.43,57.66 107.7,57.66 108.2,57.15 109.47,57.15 112.27,59.94 121.16,59.94 IC2.OUT
PIN1  (via drill 0.36)
  Top 0.152: v87.12,61.98 87.12,59.18 85.6,59.18 84.58,58.17 84.58,51.31 85.6,50.29 U2.1
  Bottom 0.152: IMP.9 v87.12,61.98
PIN2  (via drill 0.36)
  Top 0.152: v87.12,53.59 87.12,52.83 85.85,52.83 U2.2 | IMP.8 v100.08,54.61
  Bottom 0.152: v87.12,53.59 88.14,54.61 v100.08,54.61
PIN5  (via drill 0.36)
  Top 0.152: 87.88,69.85 87.38,70.36 87.38,70.61 86.61,71.37 84.07,71.37 84.07,61.72 85.6,60.2 U2.5 | 87.88,69.85 88.14,69.6 Q2.2 87.88,69.85 | IMP.7 v102.62,73.66 | v88.65,70.61 87.88,69.85
  Bottom 0.152: R3.1 v102.62,73.66 103.89,74.93 108.97,74.93 108.97,73.41 107.95,72.39 104.39,72.39 103.63,71.63 89.66,71.63 v88.65,70.61
PIN7  (via drill 0.36)
  Top 0.152: 86.61,64.26 85.85,65.02 U2.7 | 86.61,64.26 87.88,62.99 87.88,60.96 Q4.2 | 86.61,64.26 87.12,64.77 v87.12,65.02
  Bottom 0.152: v87.12,65.02 87.88,65.79 105.16,65.79 106.17,66.8 106.17,68.33 110.49,68.33 111,67.82 | 111,67.82 111.25,67.56 111.25,64.01 107.95,64.01 105.92,61.98 IMP.6 | R5.1 117.35,70.36 120.4,71.12 121.41,70.1 121.67,67.82 111,67.82
PIN8  (via drill 0.36)
  Top 0.152: v85.85,68.83 85.85,66.8 U2.8 | v104.65,68.33 106.17,66.8 106.17,63.5 IMP.5 107.7,57.66 107.95,57.4 107.95,56.13 107.7,55.88 107.7,51.56 108.2,51.05 108.2,42.42 U1.A0 | v94.23,68.83 v94.23,74.93
  Bottom 0.152: v85.85,68.83 v94.23,68.83 96.27,68.83 96.52,68.58 100.33,68.58 100.58,68.83 103.89,68.83 104.39,68.33 v104.65,68.33 | IC1.23 97.28,75.18 95.5,75.18 95.25,74.93 v94.23,74.93
PIN9  (via drill 0.36)
  Top 0.152: v84.07,58.67 84.07,49.28 85.6,47.75 U2.9 | v109.22,58.67 110.24,59.69 IMP.4 | IC1.24 101.85,67.56 102.11,67.31 102.11,63.25 101.35,62.48 v101.35,58.67 | U1.A1 107.7,39.37 105.16,39.37 105.16,43.94 105.66,44.45 105.66,50.04 106.43,50.8 106.43,55.63 105.92,56.13 v105.92,58.67
  Bottom 0.152: v109.22,58.67 v105.92,58.67 v101.35,58.67 v84.07,58.67
RELAY1
  Top 0.152: IC1.1 115.57,81.28 115.57,78.74 S2.4 | R1.1 79.25,73.15 79.25,49.78 88.39,40.64 U1.RESET
  Bottom 0.152: C4.1 109.98,42.93 90.93,42.93 U1.RESET | R1.1 85.09,73.41 86.36,72.14 87.88,72.14 87.88,73.41 89.15,74.68 89.66,74.68 90.17,74.17 95,74.17 95.5,74.68 97.28,74.68 98.04,75.44 112.52,75.44 115.57,78.49 S2.4

### Text on the board
tNames: growerbot v1